# Altium schematic sheet TK106_MIDI_Konnektorer.SchDoc
size A3; Revision: 6
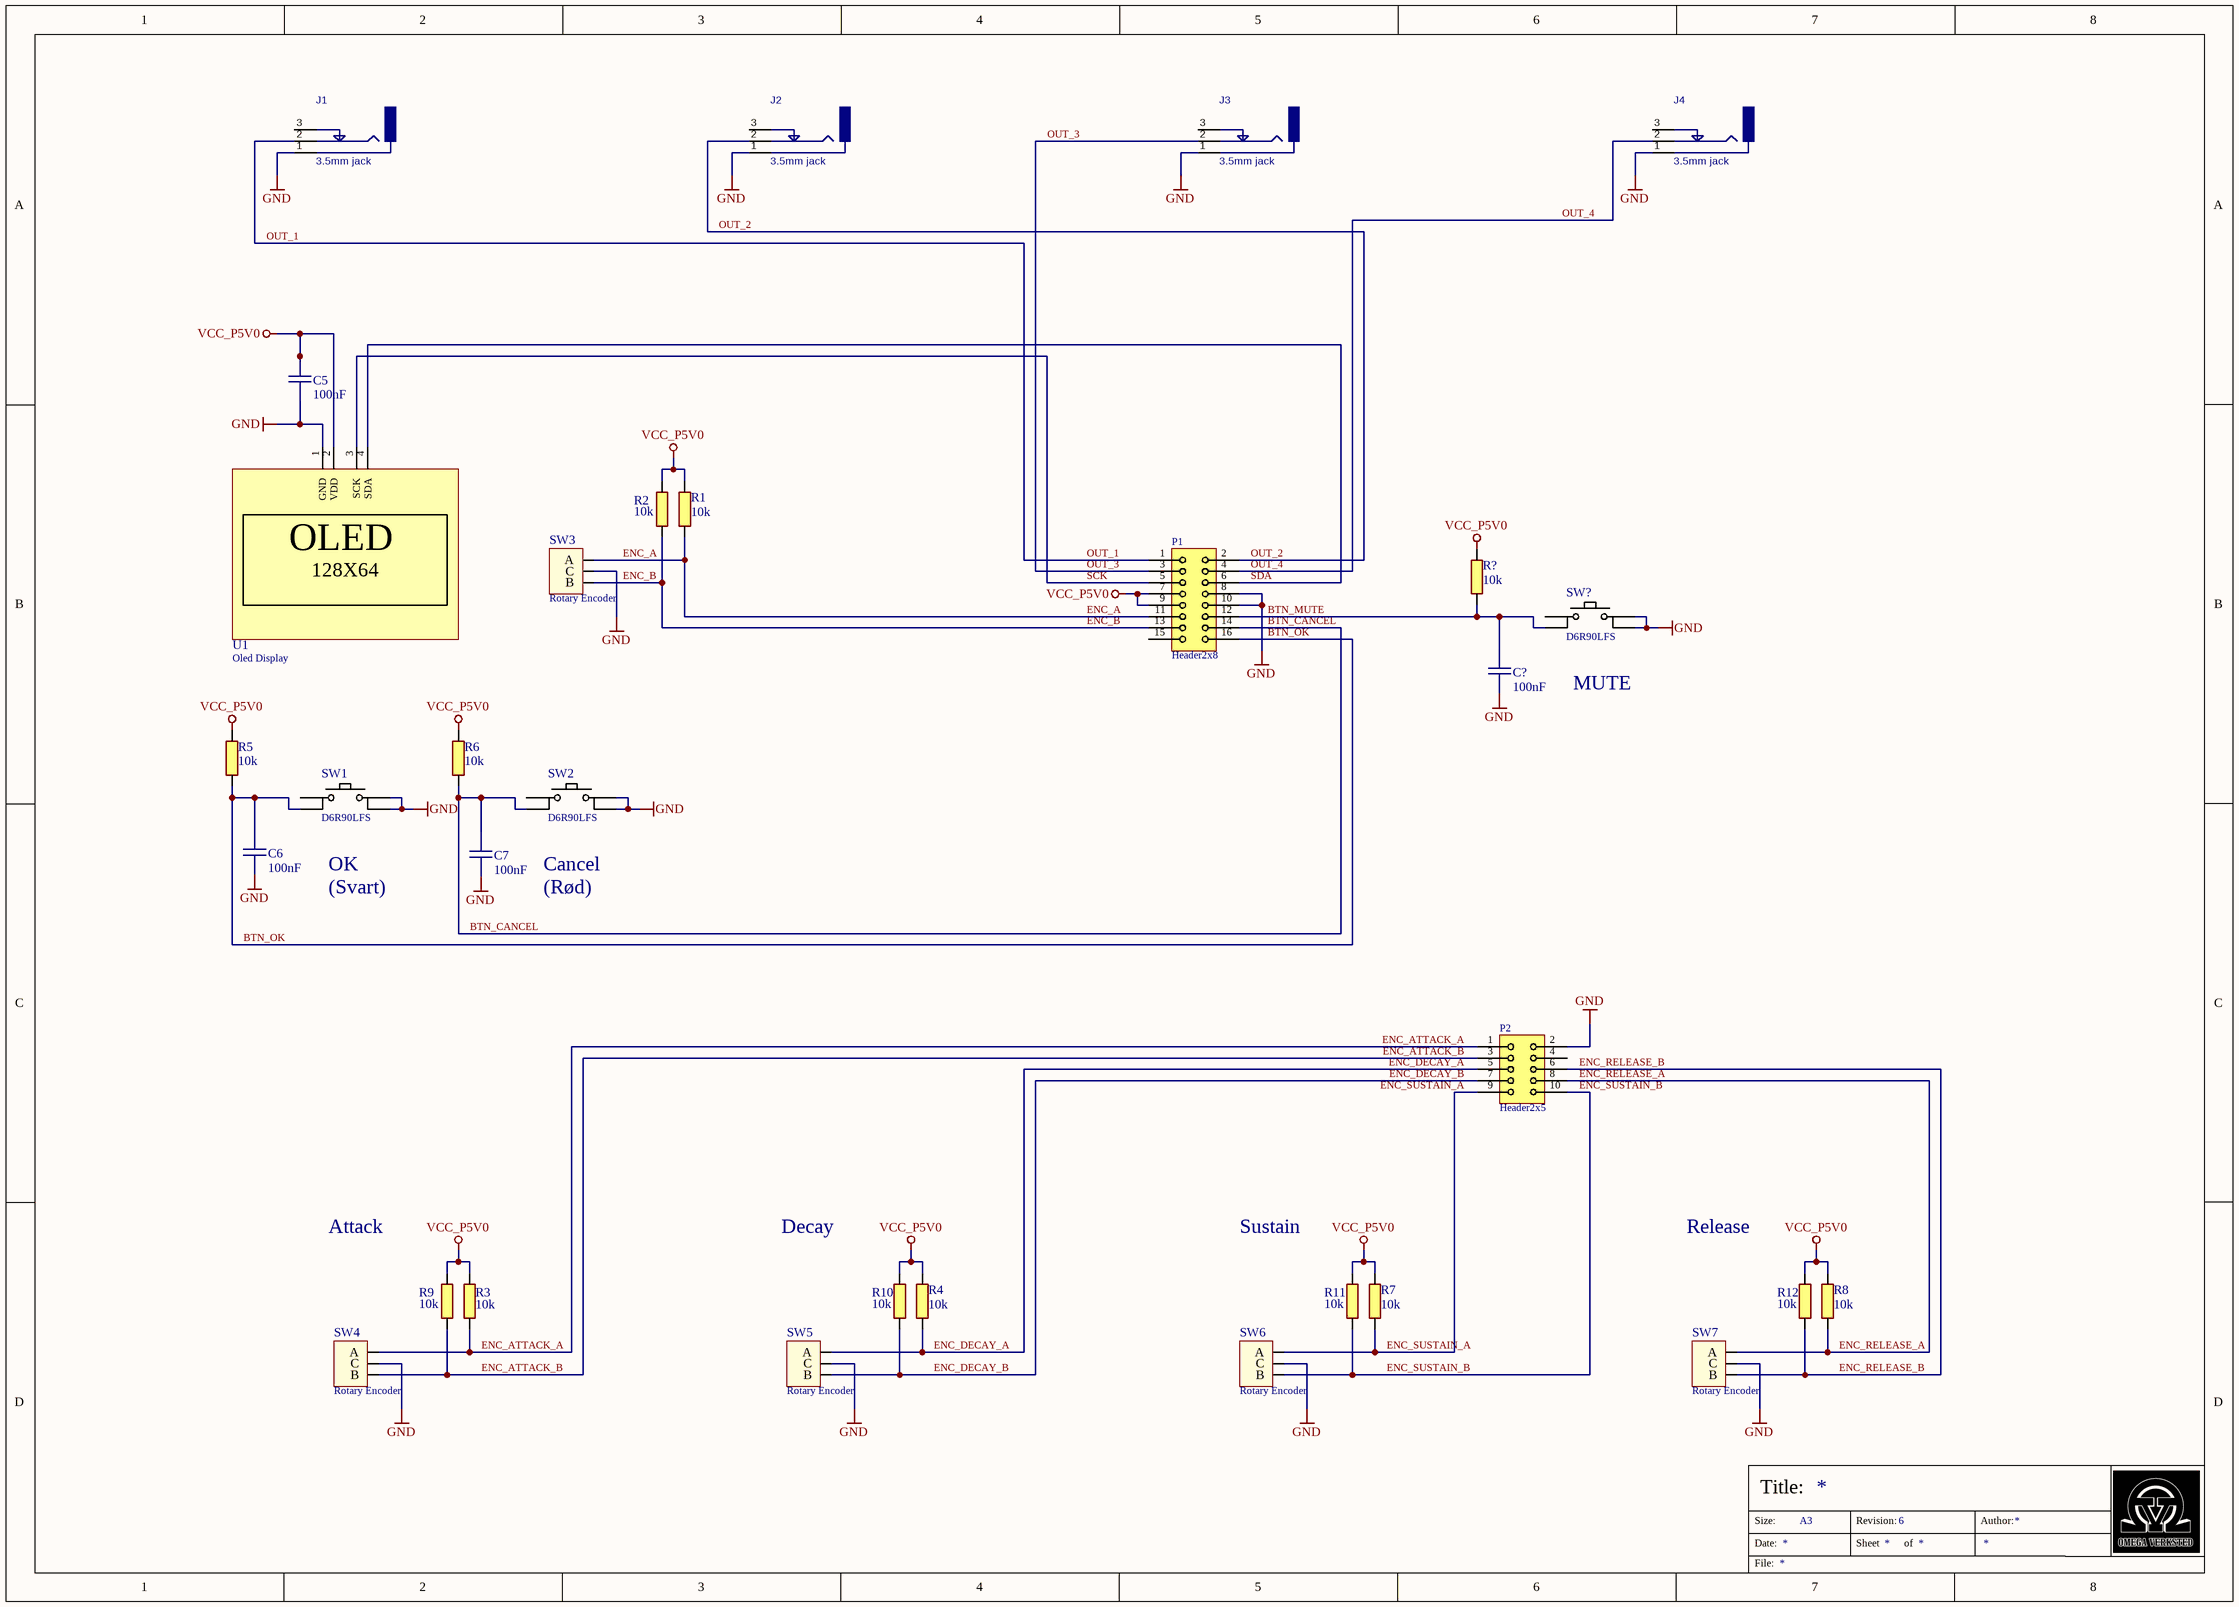
[diagram p0: TK106_MIDI_Konnektorer.SchDoc]

## Parts
C5  100nF  [CAPC0603(1608)55_N]
C6  100nF  [CAPC0603(1608)55_N]
C7  100nF  [CAPC0603(1608)55_N]
C?  100nF  [CAPC0603(1608)55_N]
J1  3.5mm jack  [PJ301BM]
J2  3.5mm jack  [PJ301BM]
J3  3.5mm jack  [PJ301BM]
J4  3.5mm jack  [PJ301BM]
P1  Header2x8  [HDRV16W64P254_2X8]
P2  Header2x5  [HDRV10W64P254_2X5]
R1  10k  [RESC0603(1608)_N]
R2  10k  [RESC0603(1608)_N]
R3  10k  [RESC0603(1608)_N]
R4  10k  [RESC0603(1608)_N]
R5  10k  [RESC0603(1608)_N]
R6  10k  [RESC0603(1608)_N]
R7  10k  [RESC0603(1608)_N]
R8  10k  [RESC0603(1608)_N]
R9  10k  [RESC0603(1608)_N]
R10  10k  [RESC0603(1608)_N]
R11  10k  [RESC0603(1608)_N]
R12  10k  [RESC0603(1608)_N]
R?  10k  [RESC0603(1608)_N]
SW1  D6R90LFS  [CK_D6R]
SW2  D6R90LFS  [CK_D6R]
SW3  Rotary Encoder  [RotaryEncoder]
SW4  Rotary Encoder  [RotaryEncoder]
SW5  Rotary Encoder  [RotaryEncoder]
SW6  Rotary Encoder  [RotaryEncoder]
SW7  Rotary Encoder  [RotaryEncoder]
SW?  D6R90LFS  [CK_D6R]
U1  Oled Display  [OLED_SSD1306_I2C]

## Nets
GND: C5.1 C6.1 C7.1 C?.1 J1.1 J2.1 J3.1 J4.1 P1.8 P1.10 P2.2 SW1.1 SW1.2 SW2.1 SW2.2 SW3.1(C) SW4.1(C) SW5.1(C) SW6.1(C) SW7.1(C) SW?.1 SW?.2 U1.1(GND)
VCC_P5V0: C5.2 P1.7 P1.9 R1.2 R2.2 R3.2 R4.2 R5.2 R6.2 R7.2 R8.2 R9.2 R10.2 R11.2 R12.2 R?.2 U1.2(VDD)
BTN_CANCEL: C7.2 P1.14 R6.1 SW2.4
BTN_MUTE: C?.2 P1.12 R?.1 SW?.4
BTN_OK: C6.2 P1.16 R5.1 SW1.4
ENC_A: P1.11 R1.1 SW3.2(A)
ENC_ATTACK_A: P2.1 R3.1 SW4.2(A)
ENC_ATTACK_B: P2.3 R9.1 SW4.3(B)
ENC_B: P1.13 R2.1 SW3.3(B)
ENC_DECAY_A: P2.5 R4.1 SW5.2(A)
ENC_DECAY_B: P2.7 R10.1 SW5.3(B)
ENC_RELEASE_A: P2.8 R8.1 SW7.2(A)
ENC_RELEASE_B: P2.6 R12.1 SW7.3(B)
ENC_SUSTAIN_A: P2.9 R7.1 SW6.2(A)
ENC_SUSTAIN_B: P2.10 R11.1 SW6.3(B)
OUT_1: J1.2 P1.1
OUT_2: J2.2 P1.2
OUT_3: J3.2 P1.3
OUT_4: J4.2 P1.4
SCK: P1.5 U1.3(SCK)
SDA: P1.6 U1.4(SDA)

Not connected (* = marked no-connect by the designer): J1 3; J2 3; J3 3; J4 3; P1 15; P2 4; SW1 3; SW2 3; SW? 3

## Notes on the sheet
- (near SW?) MUTE
- (near SW1) OK
- (Svart)
- Cancel
- (Rød)
- Attack
- Decay
- Sustain
- Release
- Size:
- Date:
- Title:
- A3
- Revision:
- Sheet
- of
- Author:
- File:
- (in symbol 4719) OLED; 128X64

## Library data of the parts
C5-C7 C? = 5152: X7R 50V 5%; id: 5152; rad: 21; rom: OV; lager_type: Baklager; dybde: 0; antall: 1000; pakke_opprettet_av: 815; leverandor_varenr: 1759122; pris: 1; nokkelord: Kondensator, Capacitor, CAP; produsent: Multikomp; leverandor: Farnell; pakketype: 0603; komponenttype: 2; hylle: 0; pakke_opprettet: 18/02/2015 14:18:13; symbol_opprettet_av: 815; symbol_opprettet: 14/11/2014 20:19:34; navn: 100nF
J1-J4 = 4712: 3-pin 3.5mm 1/8" Mono Jack PCB Panel Mount; id: 4712; pakke_opprettet_av: 815; beskrivelse: 3.5mm Mono jack; pris: 0; nokkelord: eurorack; pakketype: TH; komponenttype: 11; pakke_opprettet: 26/06/2019 21:29:25; symbol_opprettet_av: 815; symbol_opprettet: 26/06/2019 21:41:38; navn: PJ301BM
P1 = 4618: id: 4618; pakke_opprettet_av: 815; beskrivelse: Header; pris: 10; pakketype: TH; komponenttype: 11; pakke_opprettet: 14.02.2019 23:39:55; symbol_opprettet_av: 815; symbol_opprettet: 13.11.2014 11:08:32; navn: Header 2X8; nokkelord: Header
P2 = 5660: id: 5660; pakke_opprettet_av: 815; beskrivelse: Header; pris: 5; pakketype: TH; komponenttype: 11; pakke_opprettet: 31/01/2020 22:00:52; symbol_opprettet_av: 815; symbol_opprettet: 13/11/2014 11:03:55; navn: Header 2X5; nokkelord: Header
R1-R12 R? = 5264: 0.1W 1% Thick film resistor; id: 5264; rad: 1; rom: OV; lager_type: Baklager; dybde: 3; hylle: 6; antall: 1200; pakke_opprettet_av: 815; leverandor_varenr: 2447230; pris: 0; nokkelord: Resistor Motstand; produsent: Multikomp; leverandor: Farnell; pakketype: 0603; pakke_opprettet: 08/07/2014 21:15:30; symbol_opprettet_av: 815; symbol_opprettet: 08/07/2014 21:16:33; navn: 10k; komponenttype: 1
SW1 SW2 SW? = 4720: Tactile Switch, D6 Series, Top Actuated, Through Hole, Round Button, 130 gf, 100mA; id: 4720; pakke_opprettet_av: 815; leverandor_varenr: 1201375; pris: 8; produsent: C&K; leverandor: Farnell; pakke_opprettet: 27/06/2019 21:16:30; symbol_opprettet_av: 815; symbol_opprettet: 14/11/2014 21:57:30; navn: D6R90LFS
SW3-SW7 = 4370: EC12E2430804 Incremental rotary encoder; id: 4370; pakke_opprettet_av: 1150; leverandor_varenr: 2065070; pris: 15; produsent: Alps; leverandor: Farnell; pakketype: TH; pakke_opprettet: 03/11/2017 13:12:58; symbol_opprettet_av: 1150; symbol_opprettet: 03/11/2017 13:12:00; navn: Rotary Encoder
U1 = 4719: White 3-5V 0.96"I2C Serial 128X64 OLED LCD LED Display Module for Arduino. Driver: SSD1306, gm009605v4; id: 4719; rad: 6; rom: OV; lager_type: Baklager; dybde: 0; hylle: 4; antall: 16; pakke_opprettet_av: 815; pris: 20; nokkelord: I2C, Serial, 128X64, OLED, Display; pakke_opprettet: 26/06/2019 22:49:09; symbol_opprettet_av: 815; symbol_opprettet: 26/06/2019 22:55:07; navn: Oled Display; pakketype: -